# EAGLE design PCB_V1_7.1 (EAGLE 7.1.0)
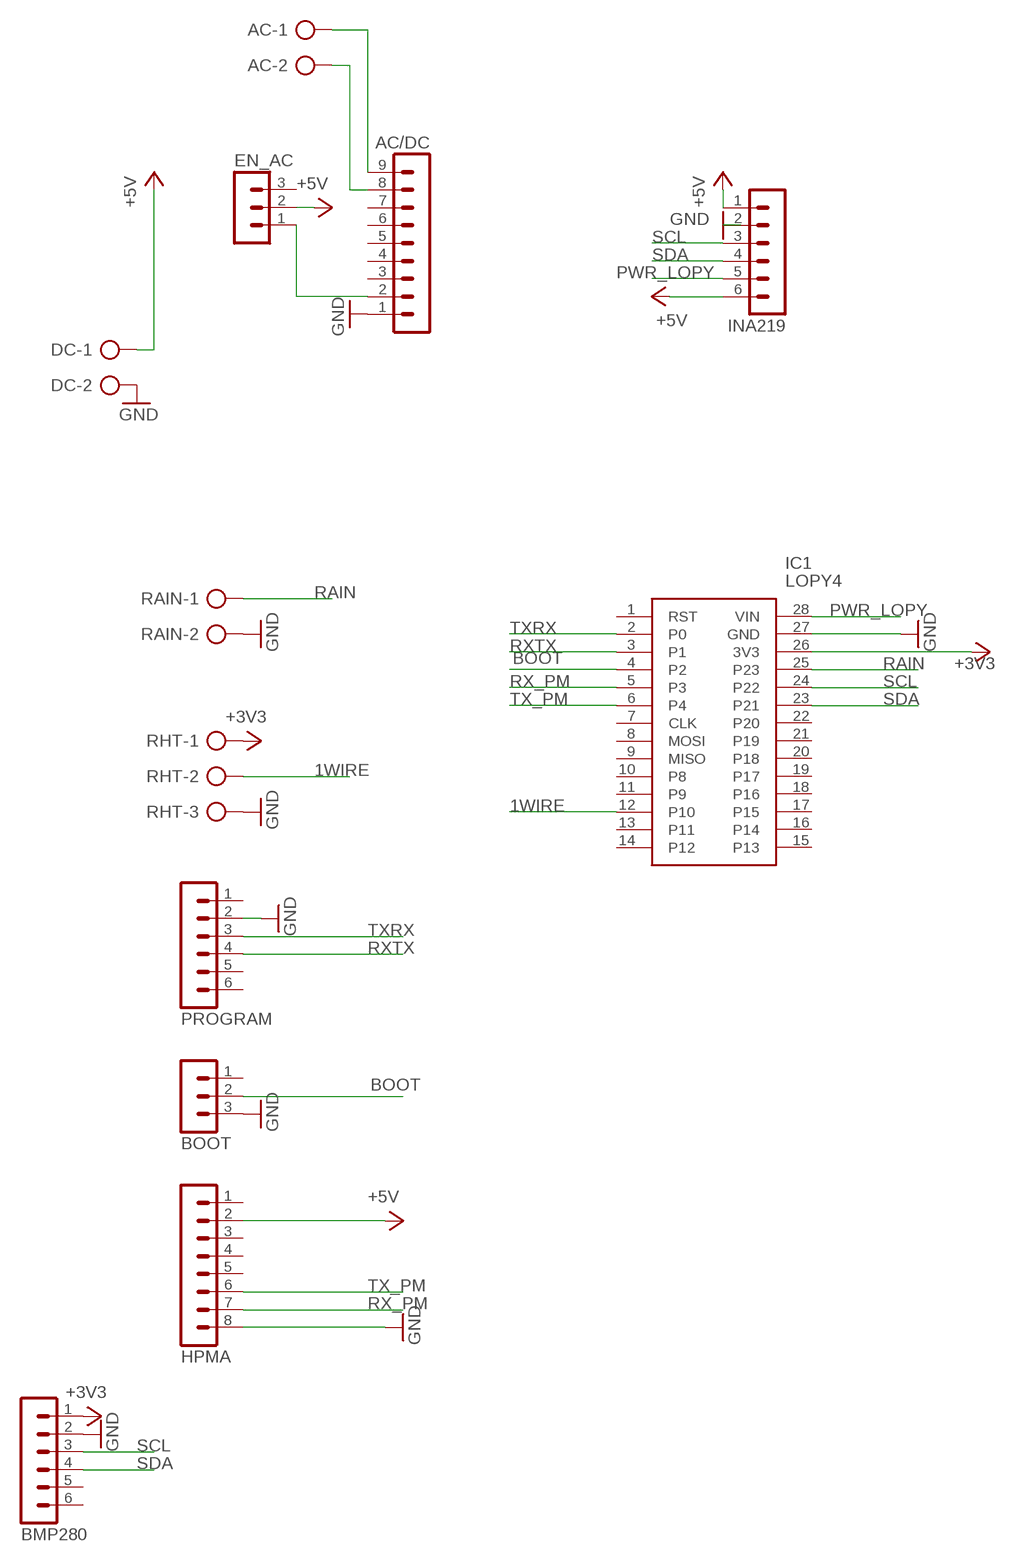
[diagram p0: schematic, sheet 1]

## Parts
AC  AK300/2  [AK300/2]
AC/DC  MA09-1  [MA09-1]
BMP280  MA06-1  [MA06-1]
BOOT  MA03-1  [MA03-1]
DC  AK300/2  [AK300/2]
EN_AC  MA03-1  [MA03-1]
HPMA  MA08-1  [MA08-1]
IC1  LOPY4  [LOPY4]
INA219  MA06-1  [MA06-1]
PROGRAM  MA06-1  [MA06-1]
RAIN  AK300/2  [AK300/2]
RHT  AK300/3  [AK300/3]

## Nets
1WIRE: IC1.12(P10) RHT.2
+3V3 [power]: BMP280.1 IC1.26(3V3) RHT.1
+5V [power]: DC.1 EN_AC.2 HPMA.2 INA219.1 INA219.6
BOOT: BOOT.2 IC1.4(P2)
GND [power]: AC/DC.1 BMP280.2 BOOT.3 DC.2 HPMA.8 IC1.27(GND) INA219.2 PROGRAM.2 RAIN.2 RHT.3
N$1 [power]: AC.1 AC/DC.9
N$2 [power]: AC.2 AC/DC.8
N$3: AC/DC.2 EN_AC.1
PWR_LOPY: IC1.28(VIN) INA219.5
RAIN: IC1.25(P23) RAIN.1
RX_PM: HPMA.7 IC1.5(P3)
RXTX: IC1.3(P1) PROGRAM.4
SCL: BMP280.3 IC1.24(P22) INA219.3
SDA: BMP280.4 IC1.23(P21) INA219.4
TX_PM: HPMA.6 IC1.6(P4)
TXRX: IC1.2(P0) PROGRAM.3
Unconnected: AC/DC.3 AC/DC.4 AC/DC.5 AC/DC.6 AC/DC.7 BMP280.5 BMP280.6 BOOT.1 EN_AC.3 HPMA.1 HPMA.3 HPMA.4 HPMA.5 IC1.1(RST) IC1.7(CLK) IC1.8(MOSI) IC1.9(MISO) IC1.10(P8) IC1.11(P9) IC1.13(P11) IC1.14(P12) IC1.15(P13) IC1.16(P14) IC1.17(P15) IC1.18(P16) IC1.19(P17) IC1.20(P18) IC1.21(P19) IC1.22(P20) PROGRAM.1 PROGRAM.5 PROGRAM.6

## Library data of the parts
AC DC RAIN = con-ptr500:AK300/2: CONNECTOR; OC_FARNELL: unknown; OC_NEWARK: unknown
AC/DC = con-lstb:MA09-1: PIN HEADER; OC_FARNELL: unknown; OC_NEWARK: unknown
BMP280 INA219 PROGRAM = con-lstb:MA06-1: PIN HEADER; OC_FARNELL: unknown; OC_NEWARK: unknown
BOOT EN_AC = con-lstb:MA03-1: PIN HEADER; OC_FARNELL: unknown; OC_NEWARK: unknown
HPMA = con-lstb:MA08-1: PIN HEADER; OC_FARNELL: unknown; OC_NEWARK: unknown
IC1 = LOPY4:LOPY4: Pycom Pycom LoPy4 Bluetooth Smart (BLE), LoRa, SigFox, WiFi Development Board Source: Datasheet <https://pycom.io/wp-content/uploads/2018/03/Pycom_Specsheet_LoPy4.pdf>; ARROW_PART_NUMBER: LOPY4; ARROW_PRICE-STOCK: https://www.arrow.com/en/products/lopy4/pycom-ltd; DESCRIPTION: Pycom Pycom LoPy4 Bluetooth Smart (BLE), LoRa, SigFox, WiFi Development Board; HEIGHT: 5mm; MANUFACTURER_NAME: Pycom; MANUFACTURER_PART_NUMBER: LOPY4; MOUSER_PART_NUMBER: 365-LOPY4; MOUSER_PRICE-STOCK: https://www.mouser.com/Search/Refine.aspx?Keyword=365-LOPY4
RHT = con-ptr500:AK300/3: CONNECTOR; OC_FARNELL: unknown; OC_NEWARK: unknown

## Net classes
0 default: width 0.254 mm
1 power: width 0.508 mm

## Board
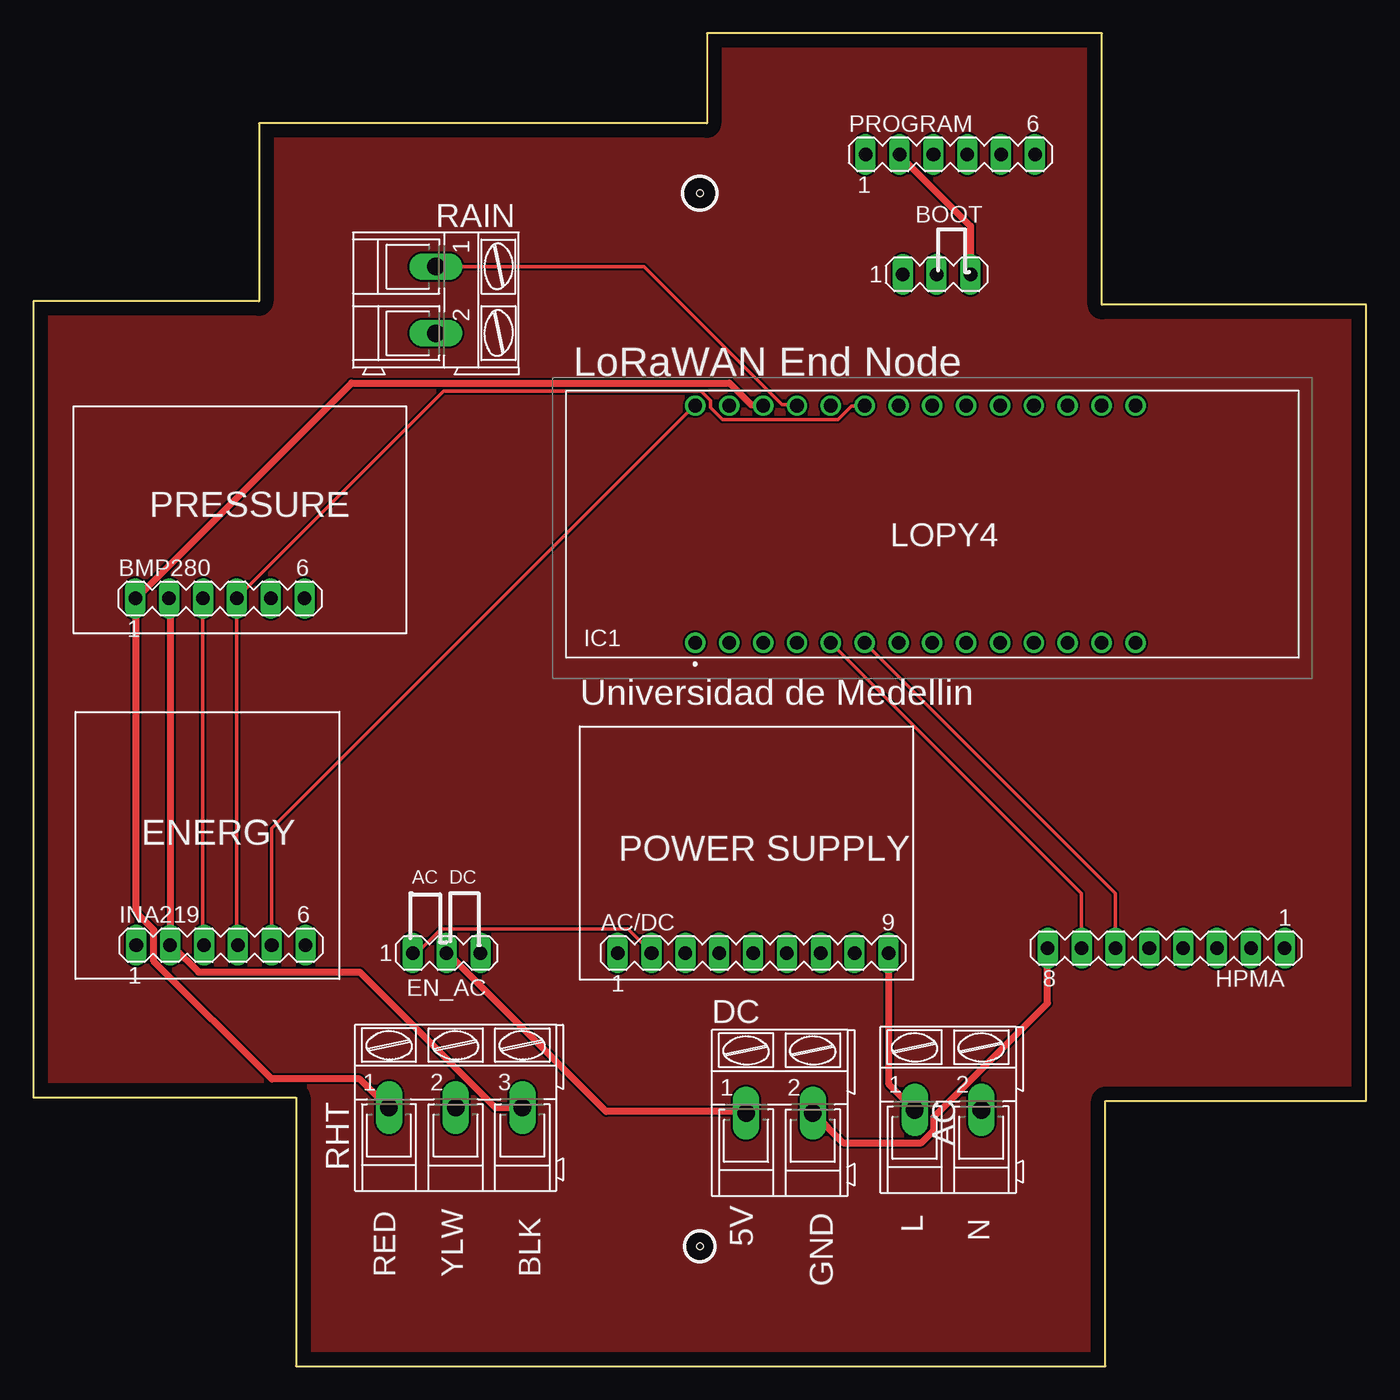
[diagram p1: board, top side]
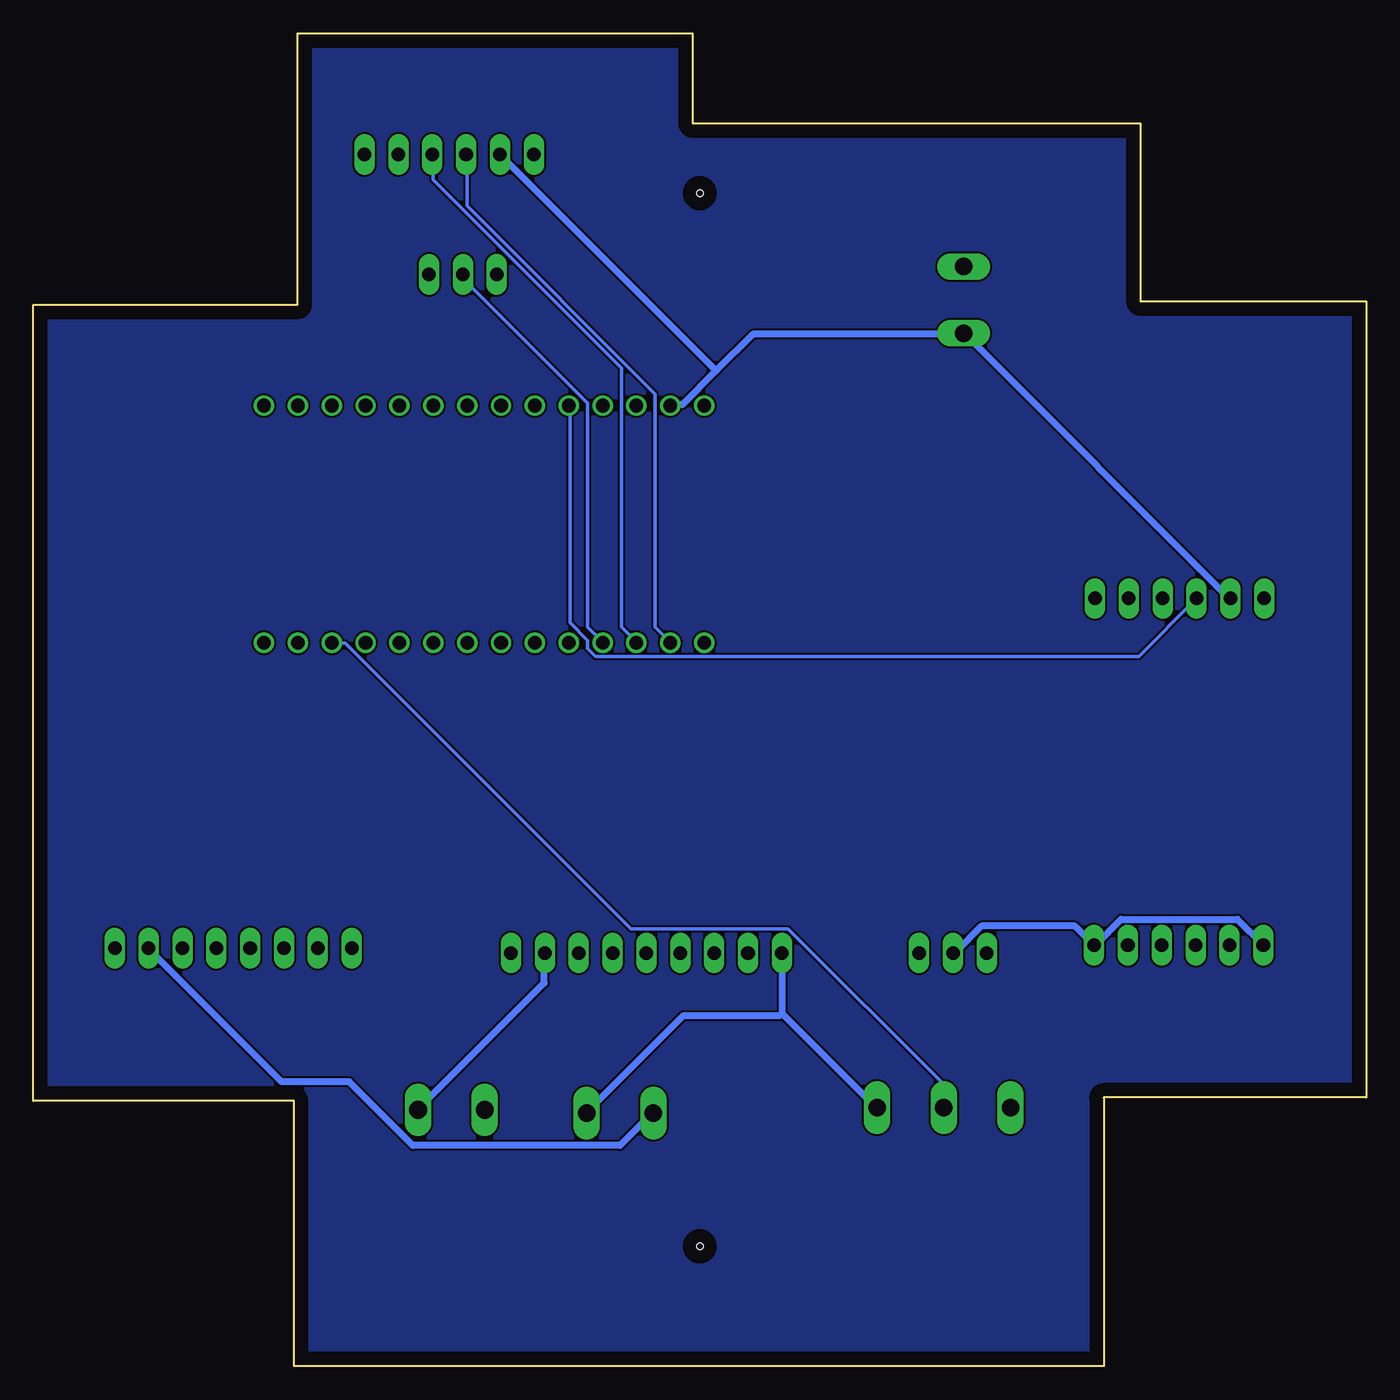
[diagram p2: board, bottom side, seen from below]

Size 100 x 100 mm. Coordinates in mm from the lower left corner, seen from the top.
Outline: 0,20.16 19.7,20.16 19.7,0 80.44,0 80.44,19.89 100,19.89 100,79.63 80.17,79.63 80.17,100 50.53,100 50.53,93.25 16.94,93.25 16.94,79.9 0,79.9 0,20.16
Copper layers (1*16): Top 0.035mm / dielectric 1.5mm / Bottom 0.035mm
Design rules "default": minimum track width 6mil, minimum drill 0.35mm, track to track 6mil, track to pad 6mil, pad to pad 6mil, via to via 6mil, smd to smd 6mil, copper to edge 40mil, drill to drill 6mil, minimum pad ring 10mil, minimum via ring 8mil, stop-mask expansion 4mil, vias tented up to drill 0mil, thermal gap 10mil
Holes 0.5 mm at 50,88 50,9

### Footprints (pad centres in the part's own frame; a part is rotated, then mirrored left to right if it is on the bottom)
AK300/2 = drill 1.321 long: 1 -2.515,0; 2 2.489,0
MA09-1 = drill 1.016 long: 1 -10.16,0; 2 -7.62,0; 3 -5.08,0; 4 -2.54,0; 5 0,0; 6 2.54,0; 7 5.08,0; 8 7.62,0; 9 10.16,0
MA06-1 = drill 1.016 long: 1 -6.35,0; 2 -3.81,0; 3 -1.27,0; 4 1.27,0; 5 3.81,0; 6 6.35,0
MA03-1 = drill 1.016 long: 1 -2.54,0; 2 0,0; 3 2.54,0
MA08-1 = drill 1.016 long: 1 -8.89,0; 2 -6.35,0; 3 -3.81,0; 4 -1.27,0; 5 1.27,0; 6 3.81,0; 7 6.35,0; 8 8.89,0
LOPY4 = drill 1.02 pad 1.53: 1 -17.78,-8.59; 2 -15.24,-8.59; 3 -12.7,-8.59; 4 -10.16,-8.59; 5 -7.62,-8.59; 6 -5.08,-8.59; 7 -2.54,-8.59; 8 0,-8.59; 9 2.54,-8.59; 10 5.08,-8.59; 11 7.62,-8.59; 12 10.16,-8.59; 13 12.7,-8.59; 14 15.24,-8.59; 15 15.24,9.19; 16 12.7,9.19; 17 10.16,9.19; 18 7.62,9.19; 19 5.08,9.19; 20 2.54,9.19; 21 0,9.19; 22 -2.54,9.19; 23 -5.08,9.19; 24 -7.62,9.19; 25 -10.16,9.19; 26 -12.7,9.19; 27 -15.24,9.19; 28 -17.78,9.19
AK300/3 = drill 1.321 long: 1 -5.004,0; 2 0,0; 3 5.004,0

### Placement (x,y rotation side)
AC  68.64,19.23 0 top
AC/DC  54,31 0 top
BMP280  14,57.6 0 top
BOOT  67.77,81.92 0 top
DC  56,19 0 top
EN_AC  31,31 0 top
HPMA  85,31.36 180 top
IC1  67.45,62.88 0 top
INA219  14.07,31.59 0 top
PROGRAM  68.8,90.92 0 top
RAIN  30.2,79.99 270 top
RHT  31.69,19.39 0 top

### Tracks (layer width: path | path; a pad name or v marks a point on that pad's centre or on a via)
1WIRE
  Bottom 0.254: IC1.12 77.52,54.25 76.61,54.25 55.17,32.82 43.38,32.82 31.7,21.13 31.7,19.41 RHT.2
+3V3
  Top 0.508: RHT.1 26.62,19.41 24.49,21.54 17.88,21.54 9.04,30.38 9.04,32.72 7.72,34.04 7.72,57.51 BMP280.1 7.82,57.71 23.88,73.76 52.22,73.76 53.85,72.14 54.66,72.14 IC1.26
+5V
  Top 0.508: EN_AC.2 31.09,30.99 42.98,19.1 53.44,19.1 DC.1
  Bottom 0.508: EN_AC.2 30.99,31.09 30.79,31.09 28.85,33.02 21.84,33.02 INA219.6 20.22,31.7 18.39,33.53 9.65,33.53 INA219.1 | HPMA.2 91.34,31.29 81.38,21.34 76.3,21.34 71.53,16.56 55.98,16.56 53.54,19 DC.1
BOOT
  Bottom 0.254: BOOT.2 67.77,81.89 67.77,81.58 58.42,72.24 58.42,55.47 57.3,54.36 IC1.4
GND
  Top 0.508: HPMA.8 76.1,31.29 76.1,27.23 67.56,18.69 67.56,17.68 66.65,16.76 60.76,16.76 58.52,19 DC.2 | BMP280.2 10.26,57.51 INA219.2 10.46,31.5 12.39,29.57 24.49,29.57 34.65,19.41 36.68,19.41 RHT.3 | BOOT.3 70.31,81.99 70.31,85.55 65.02,90.83 PROGRAM.2
  Bottom 0.508: 43.79,26.42 43.79,30.99 AC/DC.1 | 43.79,26.42 36.78,19.41 RHT.3 | 43.79,26.42 43.99,26.31 51.21,26.31 58.42,19.1 DC.2 | 48.77,74.68 46.02,77.42 30.28,77.42 RAIN.2 30.07,77.42 10.26,57.61 BMP280.2 | 48.77,74.68 51.31,72.14 52.12,72.14 IC1.27 | 48.77,74.68 64.92,90.83 PROGRAM.2
N$1
  Top 0.508: AC/DC.9 64.21,30.99 64.21,21.13 66.04,19.3 AC.1
N$2
  Bottom 0.254: 61.67,30.99 AC/DC.8
  Bottom 0.508: AC/DC.8 61.67,30.89 61.67,28.75 71.12,19.3 AC.2
N$3
  Top 0.254: EN_AC.1 28.55,31.09 28.85,31.09 30.58,32.82 44.6,32.82 46.33,31.09 AC/DC.2
N$4
  pour Bottom: 0,20.3 19.7,20.3 19.7,0.1 80.5,0.1 80.5,19.8 100,19.8 100,79.6 80.2,79.6 80.2,100 50.5,100 50.5,93.3 17,93.3 17,80 0,80 0,20.4
N$5
  pour Top: 0,20.2 19.7,20.2 19.7,0.1 80.5,0.1 80.5,19.9 100,19.9 100,79.6 80.2,79.6 80.2,100 50.5,100 50.5,93.2 17,93.2 17,79.9 0,79.9
PWR_LOPY
  Top 0.254: INA219.5 17.88,40.34 49.58,72.03 IC1.28
RAIN
  Top 0.254: IC1.25 57.2,72.14 56.19,72.14 45.82,82.5 30.28,82.5 RAIN.1
RX_PM
  Top 0.254: HPMA.7 78.64,31.39 78.64,35.46 59.84,54.25 IC1.5
RXTX
  Bottom 0.254: PROGRAM.4 70,90.83 70,89 55.88,74.88 55.88,55.47 54.76,54.36 IC1.3
SCL
  Top 0.254: BMP280.3 12.7,57.51 12.7,31.6 INA219.3
  Bottom 0.254: IC1.24 59.74,72.03 59.74,55.78 58.42,54.46 58.42,53.85 57.81,53.24 17.07,53.24 12.8,57.51 BMP280.3
SDA
  Top 0.254: INA219.4 15.24,31.6 15.24,57.51 BMP280.4 15.34,57.71 30.79,73.15 50.09,73.15 50.8,72.44 50.8,71.93 51.71,71.02 60.35,71.02 61.37,72.03 62.28,72.03 IC1.23
TX_PM
  Top 0.254: HPMA.6 81.18,31.39 81.18,35.46 62.38,54.25 IC1.6
TXRX
  Bottom 0.254: PROGRAM.3 67.46,90.83 67.46,87.07 53.34,72.95 53.34,55.47 52.22,54.36 IC1.2

### Text on the board
tNames: LoRaWAN End Node | PRESSURE | LOPY4 | Universidad de Medellin | ENERGY | POWER SUPPLY | AC | DC | L | 5V | N | RED | YLW | BLK | GND